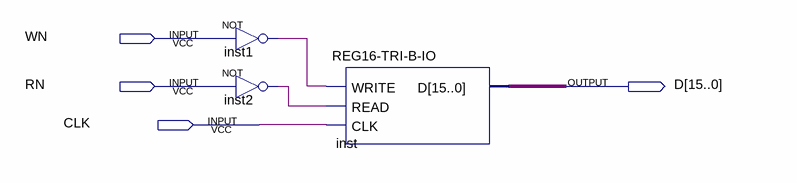
[diagram p0: schematic sheet]
// Quartus schematic REG16-TRI-B-IO-N.bdf as structural Verilog: 3 symbols, 4 pins
module \REG16-TRI-B-IO-N  (
  input  WN,
  input  RN,
  input  CLK,
  output [15:0] D
);

  wire inst1_out, inst2_out;

  not inst1 (inst1_out, WN);
  not inst2 (inst2_out, RN);
  \REG16-TRI-B-IO  inst (.WRITE(inst1_out), .READ(inst2_out), .CLK(CLK), .D(D));
endmodule
